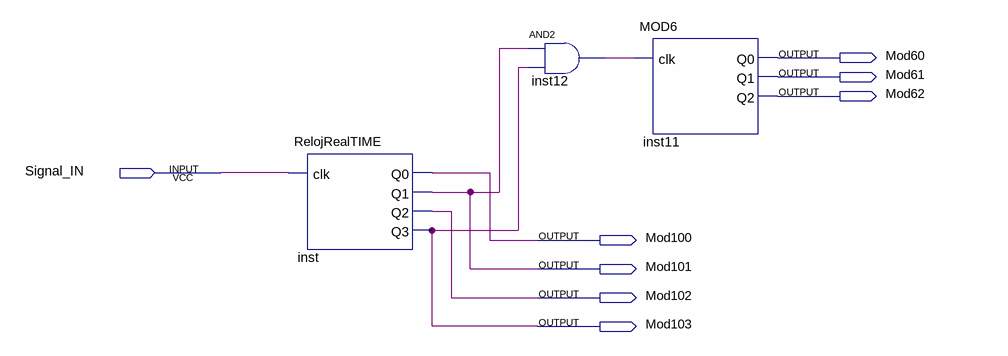
[diagram p0: schematic sheet]
// Quartus schematic Block2.bdf as structural Verilog: 3 symbols, 8 pins
module Block2 (
  input  Signal_IN,
  output Mod60,
  output Mod61,
  output Mod62,
  output Mod100,
  output Mod101,
  output Mod102,
  output Mod103
);

  wire inst12_out;

  RelojRealTIME inst (.clk(Signal_IN), .Q0(Mod100), .Q1(Mod101), .Q2(Mod102), .Q3(Mod103));
  and inst12 (inst12_out, Mod101, Mod103);
  MOD6 inst11 (.clk(inst12_out), .Q0(Mod60), .Q1(Mod61), .Q2(Mod62));
endmodule
